# EAGLE design Sparkfun_Qwiic_Shield_for_ESP32 (EAGLE 7.7.0)
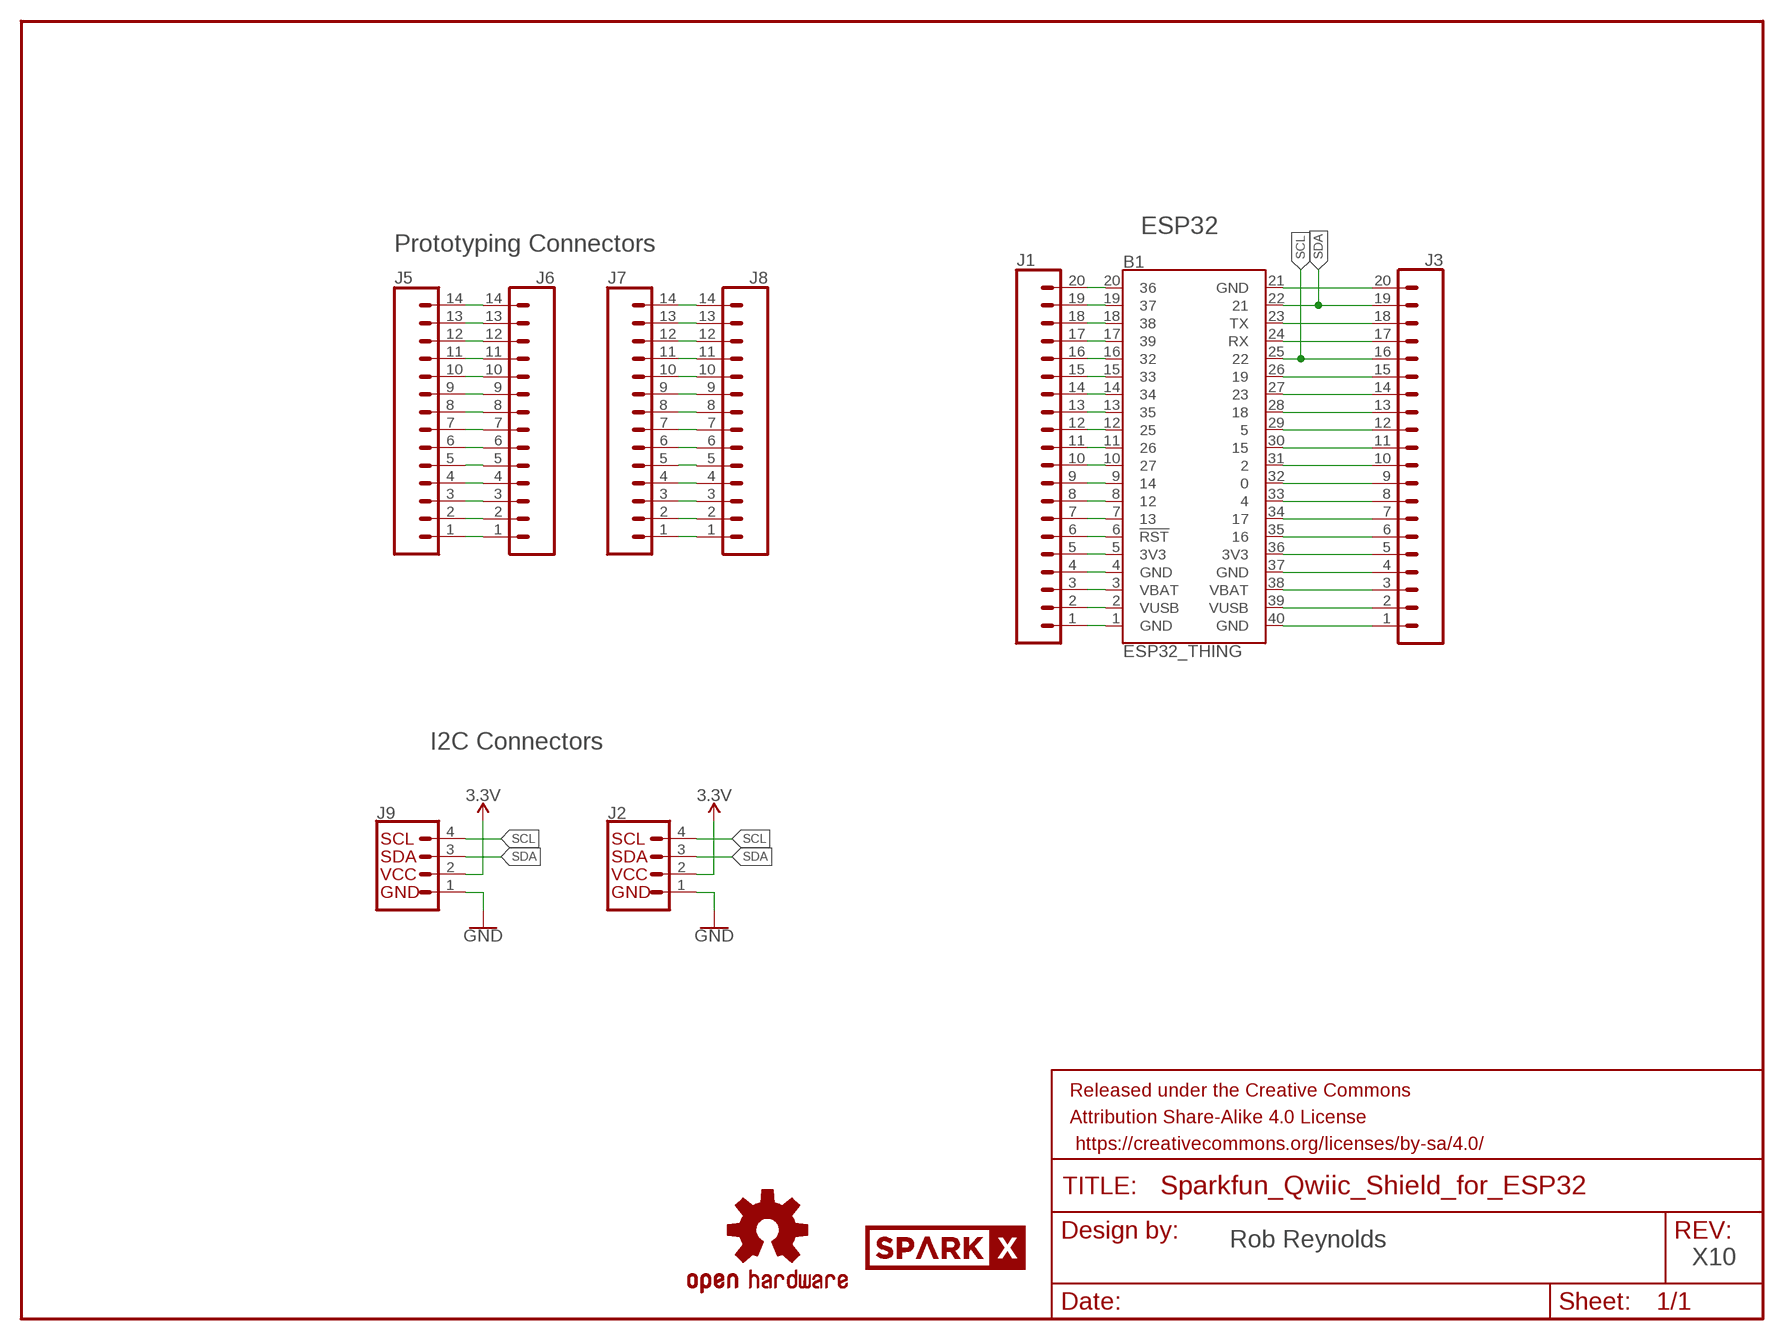
[diagram p0: schematic, sheet 1]

## Parts
B1  ESP32_THING  [ESP32_THING]
FRAME1  FRAME-LETTERNO_PACKAGE  [DUMMY]
J1  CONN_20NOSILK  [1X20_NOSILK]
J2  I2C_STANDARDJS-1MM  [1X04_1MM_RA]
J3  CONN_20NOSILK  [1X20_NOSILK]
J5  CONN_14NO_SILK  [1X14_NO_SILK]
J6  CONN_14NO_SILK  [1X14_NO_SILK]
J7  CONN_14NO_SILK  [1X14_NO_SILK]
J8  CONN_14NO_SILK  [1X14_NO_SILK]
J9  I2C_STANDARDJS-1MM  [1X04_1MM_RA]
LOGO1  OSHW-LOGOMINI  [OSHW-LOGO-MINI]
U$1  SPARKX-LOGO3  [SPARKX-SMALL]

## Nets
0: B1.32 J3.9
2: B1.31 J3.10
3.3V: B1.5(3V3) B1.36(3V3) J1.5 J2.2(VCC) J3.5 J9.2(VCC)
4: B1.33 J3.8
5: B1.29 J3.12
12: B1.8 J1.8
13: B1.7 J1.7
14: B1.9 J1.9
15: B1.30 J3.11
16: B1.35 J3.6
17: B1.34 J3.7
25: B1.12 J1.12
26: B1.11 J1.11
27: B1.10 J1.10
32: B1.16 J1.16
33: B1.15 J1.15
34: B1.14 J1.14
35: B1.13 J1.13
36: B1.20 J1.20
37: B1.19 J1.19
38: B1.18 J1.18
39: B1.17 J1.17
GND: B1.1(GND) B1.4(GND) B1.21(GND) B1.37(GND) B1.40(GND) J1.1 J1.4 J2.1(GND) J3.1 J3.4 J3.20 J9.1(GND)
MISO: B1.26 J3.15
MOSI: B1.27 J3.14
N$1: J7.1 J8.1
N$2: J7.2 J8.2
N$3: J7.3 J8.3
N$4: J7.4 J8.4
N$5: J7.5 J8.5
N$6: J7.6 J8.6
N$7: J7.7 J8.7
N$8: J7.8 J8.8
N$9: J7.9 J8.9
N$10: J7.10 J8.10
N$11: J7.11 J8.11
N$12: J7.12 J8.12
N$13: J7.13 J8.13
N$14: J7.14 J8.14
N$15: J5.1 J6.1
N$17: J5.2 J6.2
N$18: J5.3 J6.3
N$19: J5.4 J6.4
N$20: J5.5 J6.5
N$21: J5.6 J6.6
N$22: J5.7 J6.7
N$23: J5.8 J6.8
N$24: J5.9 J6.9
N$25: J5.10 J6.10
N$57: J5.11 J6.11
N$58: J5.12 J6.12
N$59: J5.13 J6.13
N$60: J5.14 J6.14
RST: B1.6(!RST!) J1.6
RX: B1.24(RX) J3.17
SCK: B1.28 J3.13
SCL: B1.25 J2.4(SCL) J3.16 J9.4(SCL)
SDA: B1.22 J2.3(SDA) J3.19 J9.3(SDA)
TX: B1.23(TX) J3.18
VBAT: B1.3(VBAT) B1.38(VBAT) J1.3 J3.3
VUSB: B1.2(VUSB) B1.39(VUSB) J1.2 J3.2

## Notes on the sheet
- ESP32
- Prototyping Connectors
- I2C Connectors
- Rob Reynolds
- X10

## Library data of the parts
B1 = SparkFun-Boards:ESP32_THING: SparkFun ESP32 Thing Board Pins, silkscreen, and logos matching the layout of the SparkFun ESP32 Thing <https://www.sparkfun.com/products/13907> Dimensions: 2.32" x 1.00"; SF_ID: DEV-13907
FRAME1 = SparkFun-Aesthetics:FRAME-LETTER: Schematic Frame - Letter Standard 8.5x11 US Letter frame; DESIGNER: Nobody; VERSION: v01
J1 J3 = SparkFun-Connectors:CONN_20: Multi connection point. Often used as Generic Header-pin footprint for 0.1 inch spaced/style header connections On any of the 0.1 inch spaced packages, you can populate with these: Break Away Headers - Straight <https://www.sparkfun.com/products/116> (PRT-00116) Break Away Male Headers - Right Angle <https://www.sparkfun.com/products/553> (PRT-00553) Female Headers <https://www.sparkfun.com/products/115> (PRT-00115) Break Away Headers - Machine Pin <https://www.sparkfun.com/products/117> (PRT-00117) Break Away Female Headers - Swiss Machine Pin <https://www.sparkfun.com/products/743> (PRT-00743) For SCREWTERMINALS and SPRING TERMINALS visit here: Screw Terimnals on SparkFun.com <https://www.sparkfun.com/search/results?term=Screw+Terminals> (5mm/3.5mm/2.54mm spacing) This device is also useful as a general connection point to wire up your design to another part of your project. Our various solder wires solder well into these plated through hole pads. Hook-Up Wire - Assortment (Stranded, 22 AWG) <https://www.sparkfun.com/products/11375> (PRT-11375) Hook-Up Wire - Assortment (Solid Core, 22 AWG) <https://www.sparkfun.com/products/11367> (PRT-11367) View the entire wire category on our website here <https://www.sparkfun.com/categories/141> Special notes: Molex polarized connector foot print use with SKU : PRT-08231 with associated crimp pins and housings. 1MM SMD Version SKU: PRT-10208 NOTES ON THE VARIANTS LOCK and LOCK_LONGPADS... This footprint was designed to help hold the alignment of a through-hole component (i.e. 6-pin header) while soldering it into place. You may notice that each hole has been shifted either up or down by 0.005 of an inch from it's more standard position (which is a perfectly straight line). This slight alteration caused the pins (the squares in the middle) to touch the edges of the holes. Because they are alternating, it causes a "brace" to hold the component in place. 0.005 has proven to be the perfect amount of "off-center" position when using our standard breakaway headers. Although looks a little odd when you look at the bare footprint, once you have a header in there, the alteration is very hard to notice. Also,if you push a header all the way into place, it is covered up entirely on the bottom side. Note about LOCK SPECIAL package: This is just like the LOCK variant in that the holes are staggared by 5 mil, but except for the last two holes. They are not altered from the "standard" footprint layout. This is used for a special purpose on the layout of our Graphic LCD Backpack. Make sure you want to use this device before selecting it for you project!
J2 J9 = SparkX:I2C_STANDARD: SparkFun I2C Standard Pinout Header SparkFun has standardized on a pinout for all I2C based sensor breakouts. This pinout allows I2C boards to be plugged directly into the headers on Arduino Uno compatible boards, and to be daisy chained easily. Example SparkFun Products: SparkFun Atmospheric Sensor Breakout - BME280 <https://www.sparkfun.com/products/13676> SparkFun Altitude/Pressure Sensor Breakout - MPL3115A2 <https://www.sparkfun.com/products/11084> SparkFun TOF Range Finder Sensor - VL6180 <https://www.sparkfun.com/products/12785>
J5-J8 = SparkFun-Connectors:CONN_14: Multi connection point. Often used as Generic Header-pin footprint for 0.1 inch spaced/style header connections On any of the 0.1 inch spaced packages, you can populate with these: Break Away Headers - Straight <https://www.sparkfun.com/products/116> (PRT-00116) Break Away Male Headers - Right Angle <https://www.sparkfun.com/products/553> (PRT-00553) Female Headers <https://www.sparkfun.com/products/115> (PRT-00115) Break Away Headers - Machine Pin <https://www.sparkfun.com/products/117> (PRT-00117) Break Away Female Headers - Swiss Machine Pin <https://www.sparkfun.com/products/743> (PRT-00743) For SCREWTERMINALS and SPRING TERMINALS visit here: Screw Terimnals on SparkFun.com <https://www.sparkfun.com/search/results?term=Screw+Terminals> (5mm/3.5mm/2.54mm spacing) This device is also useful as a general connection point to wire up your design to another part of your project. Our various solder wires solder well into these plated through hole pads. Hook-Up Wire - Assortment (Stranded, 22 AWG) <https://www.sparkfun.com/products/11375> (PRT-11375) Hook-Up Wire - Assortment (Solid Core, 22 AWG) <https://www.sparkfun.com/products/11367> (PRT-11367) View the entire wire category on our website here <https://www.sparkfun.com/categories/141> Special notes: Molex polarized connector foot print use with SKU : PRT-08231 with associated crimp pins and housings. 1MM SMD Version SKU: PRT-10208 NOTES ON THE VARIANTS LOCK and LOCK_LONGPADS... This footprint was designed to help hold the alignment of a through-hole component (i.e. 6-pin header) while soldering it into place. You may notice that each hole has been shifted either up or down by 0.005 of an inch from it's more standard position (which is a perfectly straight line). This slight alteration caused the pins (the squares in the middle) to touch the edges of the holes. Because they are alternating, it causes a "brace" to hold the component in place. 0.005 has proven to be the perfect amount of "off-center" position when using our standard breakaway headers. Although looks a little odd when you look at the bare footprint, once you have a header in there, the alteration is very hard to notice. Also,if you push a header all the way into place, it is covered up entirely on the bottom side.
LOGO1 = SparkFun-Aesthetics:OSHW-LOGO: Open-Source Hardware (OSHW) Logo This logo indicates the piece of hardware it is found on incorporates a OSHW license and/or adheres to the definition of open source hardware found here: http://freedomdefined.org/OSHW
U$1 = SparkX:SPARKX-LOGO

## Board
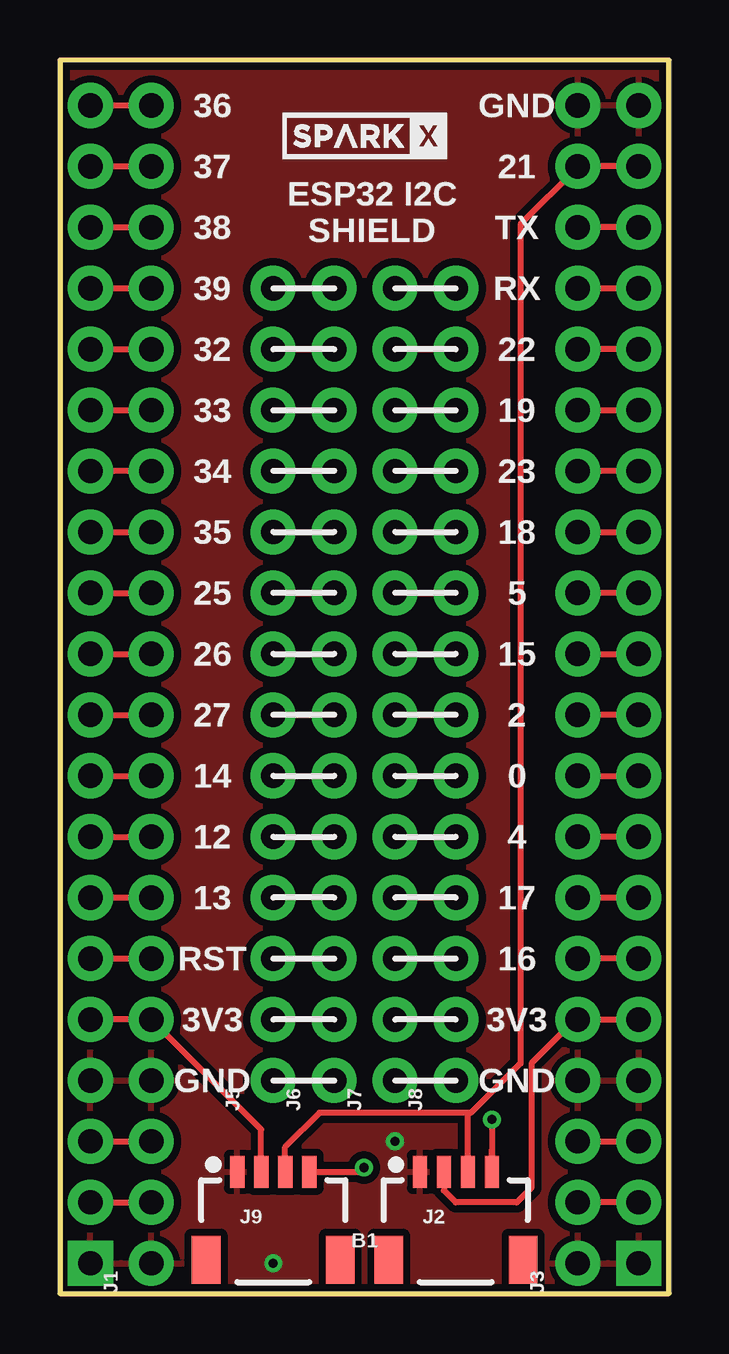
[diagram p1: board, top side]
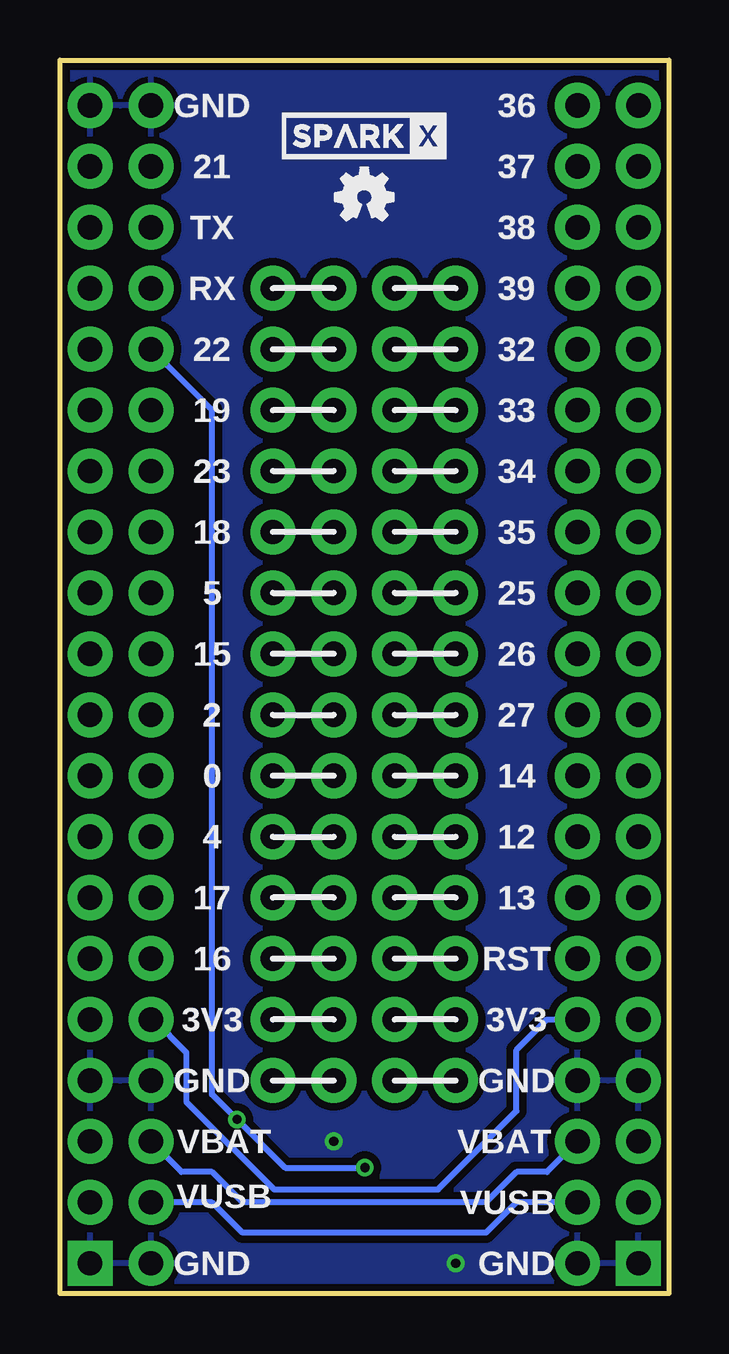
[diagram p2: board, bottom side, seen from below]

Size 25.39 x 51.42 mm. Coordinates in mm from the lower left corner, seen from the top.
Outline: 0,0 25.39,0 25.39,51.42 0,51.42 0,0
Copper layers (1*16): Top 0.035mm / dielectric 1.5mm / Bottom 0.035mm
Design rules "SparkFun-2-layer-TIGHT *": minimum track width 7mil, minimum drill 15mil, track to track 7mil, track to pad 7mil, pad to pad 7mil, via to via 7mil, smd to smd 7mil, copper to edge 7mil, drill to drill 7mil, minimum pad ring 7mil, minimum via ring 7mil, stop-mask expansion 4mil, vias tented up to drill 25mil, thermal gap 10mil

### Footprints (pad centres in the part's own frame; a part is rotated, then mirrored left to right if it is on the bottom)
ESP32_THING = drill 1.016 pad 1.88 square: 1 1.27,1.27; 40 24.13,1.27 | drill 1.016 pad 1.88: 2 1.27,3.81; 3 1.27,6.35; 4 1.27,8.89; 5 1.27,11.43; 6 1.27,13.97; 7 1.27,16.51; 8 1.27,19.05; 9 1.27,21.59; 10 1.27,24.13; 11 1.27,26.67; 12 1.27,29.21; 13 1.27,31.75; 14 1.27,34.29; 15 1.27,36.83; 16 1.27,39.37; 17 1.27,41.91; 18 1.27,44.45; 19 1.27,46.99; 20 1.27,49.53; 21 24.13,49.53; 22 24.13,46.99; 23 24.13,44.45; 24 24.13,41.91; 25 24.13,39.37; 26 24.13,36.83; 27 24.13,34.29; 28 24.13,31.75; 29 24.13,29.21; 30 24.13,26.67; 31 24.13,24.13; 32 24.13,21.59; 33 24.13,19.05; 34 24.13,16.51; 35 24.13,13.97; 36 24.13,11.43; 37 24.13,8.89; 38 24.13,6.35; 39 24.13,3.81
1X20_NOSILK = drill 1.016 pad 1.88: 1 0,0; 2 2.54,0; 3 5.08,0; 4 7.62,0; 5 10.16,0; 6 12.7,0; 7 15.24,0; 8 17.78,0; 9 20.32,0; 10 22.86,0; 11 25.4,0; 12 27.94,0; 13 30.48,0; 14 33.02,0; 15 35.56,0; 16 38.1,0; 17 40.64,0; 18 43.18,0; 19 45.72,0; 20 48.26,0
1X04_1MM_RA = smd 0.6 x 1.35: 1 -1.5,0; 2 -0.5,0; 3 0.5,0; 4 1.5,0 | smd 1.2 x 2: NC1 2.8,-3.675; NC2 -2.8,-3.675
1X14_NO_SILK = drill 1.016 pad 1.88: 1 0,0; 2 2.54,0; 3 5.08,0; 4 7.62,0; 5 10.16,0; 6 12.7,0; 7 15.24,0; 8 17.78,0; 9 20.32,0; 10 22.86,0; 11 25.4,0; 12 27.94,0; 13 30.48,0; 14 33.02,0

### Placement (x,y rotation side)
B1  0,0 0 top
FRAME1  -7.62,-8.89 0 top  (outside the outline)
J1  3.81,1.27 90 top
J2  16.51,5.08 0 top
J3  21.59,1.27 90 top
J5  8.89,8.89 90 top
J6  11.43,8.89 90 top
J7  13.97,8.89 90 top
J8  16.51,8.89 90 top
J9  8.89,5.08 0 top
LOGO1  12.7,45.72 0 bottom
U$1  12.7,48.26 0 top
U$2  SPARKX-LOGO3  [SPARKX-SMALL]  12.7,48.26 0 bottom

### Tracks (layer width: path | path; a pad name or v marks a point on that pad's centre or on a via)
0
  Top 0.254: J3.9 B1.32
2
  Top 0.254: B1.31 J3.10
3.3V
  Top 0.254: B1.5 J1.5 8.39,6.85 J9.2 | B1.36 J3.5 21.49,11.43 19.66,9.6 19.66,4.42 19.05,3.81 16.51,3.81 16.01,4.31 J2.2
  Bottom 0.254: J3.5 21.49,11.43 20.12,10.06 20.12,8 16.46,4.34 9.63,4.34 6.35,7.62 6.35,10.16 5.08,11.43 J1.5
4
  Top 0.254: B1.33 J3.8
5
  Top 0.254: B1.29 J3.12
12
  Top 0.254: B1.8 J1.8
13
  Top 0.254: B1.7 J1.7
14
  Top 0.254: B1.9 J1.9
15
  Top 0.254: J3.11 B1.30
16
  Top 0.254: B1.35 J3.6
17
  Top 0.254: J3.7 B1.34
25
  Top 0.254: B1.12 J1.12
26
  Top 0.254: B1.11 J1.11
27
  Top 0.254: B1.10 J1.10
32
  Top 0.254: B1.16 J1.16
33
  Top 0.254: B1.15 J1.15
34
  Top 0.254: J1.14 B1.14
35
  Top 0.254: B1.13 J1.13
36
  Top 0.254: B1.20 J1.20
37
  Top 0.254: B1.19 J1.19
38
  Top 0.254: B1.18 J1.18
39
  Top 0.254: B1.17 J1.17
GND  (via drill 0.38)
  other vias: 8.89,1.27 13.97,6.35
  pour Top (isolate 0.305): 0,0 0,51.44 25.4,51.44 25.4,0
  pour Bottom (isolate 0.305): 0,0 0,51.44 25.4,51.44 25.4,0
MISO
  Top 0.254: J3.15 B1.26
MOSI
  Top 0.254: B1.27 J3.14
N$1
  Top 0.254: J7.1 J8.1
N$2
  Top 0.254: J8.2 J7.2
N$3
  Top 0.254: J7.3 J8.3
N$4
  Top 0.254: J7.4 J8.4
N$5
  Top 0.254: J7.5 J8.5
N$6
  Top 0.254: J7.6 J8.6
N$7
  Top 0.254: J7.7 J8.7
N$8
  Top 0.254: J7.8 J8.8
N$9
  Top 0.254: J7.9 J8.9
N$10
  Top 0.254: J7.10 J8.10
N$11
  Top 0.254: J8.11 J7.11
N$12
  Top 0.254: J7.12 J8.12
N$13
  Top 0.254: J7.13 J8.13
N$14
  Top 0.254: J7.14 J8.14
N$15
  Top 0.254: J5.1 J6.1
N$17
  Top 0.254: J6.2 J5.2
N$18
  Top 0.254: J5.3 J6.3
N$19
  Top 0.254: J6.4 J5.4
N$20
  Top 0.254: J5.5 J6.5
N$21
  Top 0.254: J5.6 J6.6
N$22
  Top 0.254: J5.7 J6.7
N$23
  Top 0.254: J5.8 J6.8
N$24
  Top 0.254: J5.9 J6.9
N$25
  Top 0.254: J5.10 J6.10
N$57
  Top 0.254: J6.11 J5.11
N$58
  Top 0.254: J5.12 J6.12
N$59
  Top 0.254: J5.13 J6.13
N$60
  Top 0.254: J5.14 J6.14
RST
  Top 0.254: B1.6 J1.6
RX
  Top 0.254: J3.17 B1.24
SCK
  Top 0.254: J3.13 B1.28
SCL  (via drill 0.38)
  Top 0.254: 18.01,5.99 J2.4 v18.01,7.26 | B1.25 J3.16 | J9.4 12.5,5.08 v12.68,5.26
  Bottom 0.254: v12.68,5.26 16,5.26 v18.01,7.26 19.05,8.31 19.05,36.83 J3.16
SDA
  Top 0.254: J9.3 9.39,6.11 10.82,7.54 17.02,7.54 | 17.02,7.54 17.14,7.54 19.2,9.6 19.2,44.58 21.59,46.97 J3.19 B1.22 | J2.3 17.01,7.54 17.02,7.54
TX
  Top 0.254: B1.23 J3.18
VBAT
  Top 0.254: J3.3 B1.38 | B1.3 J1.3
  Bottom 0.254: J1.3 5.08,5.08 6.35,5.08 7.62,3.81 17.78,3.81 19.05,5.08 20.32,5.08 J3.3
VUSB
  Top 0.254: B1.2 J1.2 | B1.39 J3.2
  Bottom 0.254: J1.2 6.35,3.81 7.62,2.54 17.78,2.54 19.05,3.81 J3.2

### Text on the board
tPlace: 36 | GND | 37 | 21 | ESP32 I2C / SHIELD | 38 | TX | 39 | RX | 32 | 22 | 33 | 19 | 34 | 23 | 35 | 18 | 25 | 5 | 26 | 15 | 27 | 2 | 14 | 0 | 12 | 4 | 13 | 17 | RST | 16 | 3V3 | 3V3 | GND | GND
bPlace: 36 | GND | 37 | 21 | 38 | TX | 39 | RX | 32 | 22 | 33 | 19 | 34 | 23 | 35 | 18 | 25 | 5 | 26 | 15 | 27 | 2 | 14 | 0 | 12 | 4 | 13 | 17 | RST | 16 | 3V3 | 3V3 | GND | GND | VBAT | VBAT | VUSB | VUSB | GND | GND